# EAGLE schematic Amplifier (EAGLE 9.6.2)
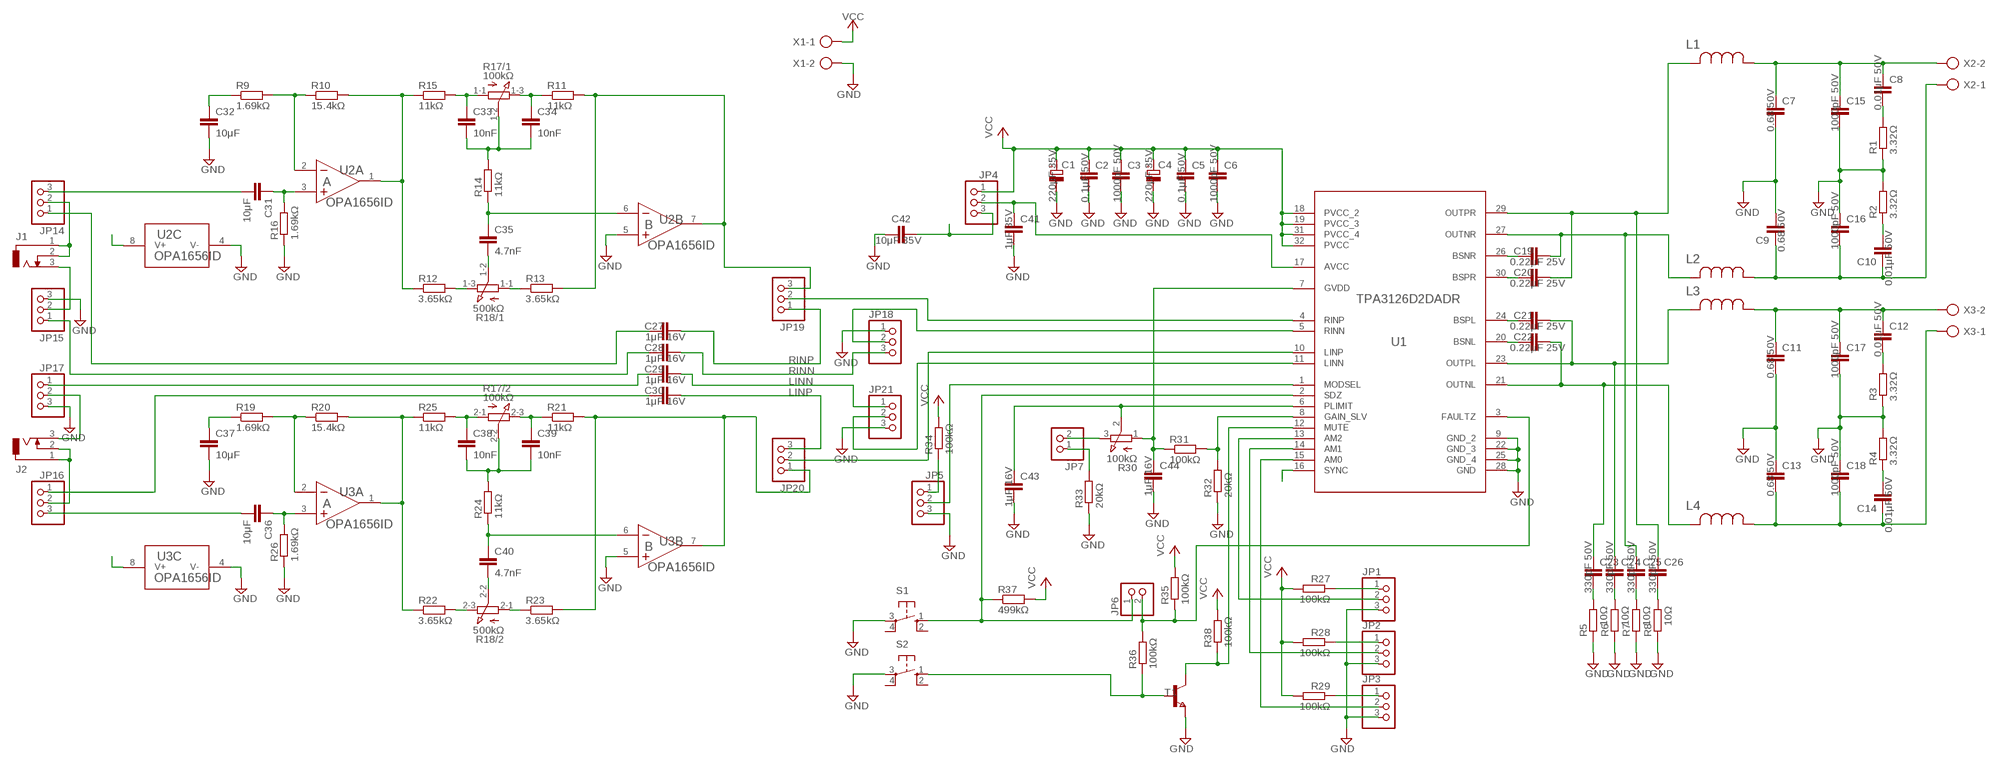
[diagram p0: schematic, sheet 1]

## Parts
C1  220μF 35V  CPOL-EUE3.5-10  [E3,5-10]
C2  0.1μF 50V  C-EUC0805  [C0805]
C3  1000pF 50V  C-EUC0805  [C0805]
C4  220μF 35V  CPOL-EUE3.5-10  [E3,5-10]
C5  0.1μF 50V  C-EUC0805  [C0805]
C6  1000pF 50V  C-EUC0805  [C0805]
C7  0.68 50V  C-EUC0805  [C0805]
C8  0.01μF 50V  C-EUC0805  [C0805]
C9  0.68 50V  C-EUC0805  [C0805]
C10  0.01μF 50V  C-EUC0805  [C0805]
C11  0.68 50V  C-EUC0805  [C0805]
C12  0.01μF 50V  C-EUC0805  [C0805]
C13  0.68 50V  C-EUC0805  [C0805]
C14  0.01μF 50V  C-EUC0805  [C0805]
C15  1000pF 50V  C-EUC0603  [C0603]
C16  1000pF 50V  C-EUC0603  [C0603]
C17  1000pF 50V  C-EUC0603  [C0603]
C18  1000pF 50V  C-EUC0603  [C0603]
C19  0.22μF 25V  C-EUC0603  [C0603]
C20  0.22μF 25V  C-EUC0603  [C0603]
C21  0.22μF 25V  C-EUC0603  [C0603]
C22  0.22μF 25V  C-EUC0603  [C0603]
C23  330pF 50V  C-EUC0603  [C0603]
C24  330pF 50V  C-EUC0603  [C0603]
C25  330pF 50V  C-EUC0603  [C0603]
C26  330pF 50V  C-EUC0603  [C0603]
C27  1μF 16V  C-EUC0805  [C0805]
C28  1μF 16V  C-EUC0805  [C0805]
C29  1μF 16V  C-EUC0805  [C0805]
C30  1μF 16V  C-EUC0805  [C0805]
C31  10μF  C-EUC0805  [C0805]
C32  10μF  C-EUC0805  [C0805]
C33  10nF  C-EUC0603  [C0603]
C34  10nF  C-EUC0603  [C0603]
C35  4.7nF  C-EUC0603  [C0603]
C36  10μF  C-EUC0805  [C0805]
C37  10μF  C-EUC0805  [C0805]
C38  10nF  C-EUC0603  [C0603]
C39  10nF  C-EUC0603  [C0603]
C40  4.7nF  C-EUC0603  [C0603]
C41  1μF 35V  C-EUC0603  [C0603]
C42  10μF 35V  C-EUC1210  [C1210]
C43  1μF 16V  C-EUC0805  [C0805]
C44  1μF 16V  C-EUC0805  [C0805]
J1  DCJ0303  [DCJ0303]
J2  DCJ0303  [DCJ0303]
JP1  PINHD-1X3  [1X03]
JP2  PINHD-1X3  [1X03]
JP3  PINHD-1X3  [1X03]
JP4  PINHD-1X3  [1X03]
JP5  PINHD-1X3  [1X03]
JP6  PINHD-1X2  [1X02]
JP7  PINHD-1X2  [1X02]
JP14  PINHD-1X3  [1X03]
JP15  PINHD-1X3  [1X03]
JP16  PINHD-1X3  [1X03]
JP17  PINHD-1X3  [1X03]
JP18  PINHD-1X3  [1X03]
JP19  PINHD-1X3  [1X03]
JP20  PINHD-1X3  [1X03]
JP21  PINHD-1X3  [1X03]
L1  7447709100  [IND_1210-WE-PD_WRE]
L2  7447709100  [IND_1210-WE-PD_WRE]
L3  7447709100  [IND_1210-WE-PD_WRE]
L4  7447709100  [IND_1210-WE-PD_WRE]
R1  3.32Ω  R-EU_R0603  [R0603]
R2  3.32Ω  R-EU_R0603  [R0603]
R3  3.32Ω  R-EU_R0603  [R0603]
R4  3.32Ω  R-EU_R0603  [R0603]
R5  10Ω  R-EU_R0805  [R0805]
R6  10Ω  R-EU_R0805  [R0805]
R7  10Ω  R-EU_R0805  [R0805]
R8  10Ω  R-EU_R0805  [R0805]
R9  1.69kΩ  R-EU_R1206  [R1206]
R10  15.4kΩ  R-EU_R1206  [R1206]
R11  11kΩ  R-EU_R1206  [R1206]
R12  3.65kΩ  R-EU_R1206  [R1206]
R13  3.65kΩ  R-EU_R1206  [R1206]
R14  11kΩ  R-EU_R1206  [R1206]
R15  11kΩ  R-EU_R1206  [R1206]
R16  1.69kΩ  R-EU_R1206  [R1206]
R17  100kΩ  3RP/1610G  [3RP/1610G]
R18  500kΩ  3RP/1610G  [3RP/1610G]
R19  1.69kΩ  R-EU_R1206  [R1206]
R20  15.4kΩ  R-EU_R1206  [R1206]
R21  11kΩ  R-EU_R1206  [R1206]
R22  3.65kΩ  R-EU_R1206  [R1206]
R23  3.65kΩ  R-EU_R1206  [R1206]
R24  11kΩ  R-EU_R1206  [R1206]
R25  11kΩ  R-EU_R1206  [R1206]
R26  1.69kΩ  R-EU_R1206  [R1206]
R27  100kΩ  R-EU_M0805  [M0805]
R28  100kΩ  R-EU_M0805  [M0805]
R29  100kΩ  R-EU_M0805  [M0805]
R30  100kΩ  3RP/1610N  [3RP/1610N]
R31  100kΩ  R-EU_R0805  [R0805]
R32  20kΩ  R-EU_R0805  [R0805]
R33  20kΩ  R-EU_R0805  [R0805]
R34  100kΩ  R-EU_R0805  [R0805]
R35  100kΩ  R-EU_R0805  [R0805]
R36  100kΩ  R-EU_R0805  [R0805]
R37  499kΩ  R-EU_R0805  [R0805]
R38  100kΩ  R-EU_R0805  [R0805]
S1  10-XX  [B3F-10XX]
S2  10-XX  [B3F-10XX]
T1  NPNSOT23  [SOT-23]
U1  TPA3126D2DADR  [DAD0032A_N]
U2  OPA1656ID  [D0008A_N]
U3  OPA1656ID  [D0008A_N]
X1  AK500/2  [AK500/2]
X2  AK500/2  [AK500/2]
X3  AK500/2  [AK500/2]

## Nets
GND: C1.- C2.2 C3.2 C4.- C5.2 C6.2 C7.2 C9.2 C11.2 C13.1 C15.2 C16.1 C17.2 C18.1 C32.2 C37.2 C41.2 C42.1 C43.2 C44.2 JP1.3 JP2.3 JP3.3 JP5.3 JP15.3 JP17.3 JP18.1 JP21.3 R1.1 R2.2 R3.1 R4.2 R5.1 R6.1 R7.1 R8.1 R16.1 R26.1 R32.1 R33.1 S1.3(P) S2.3(P) T1.2(E) U1.9(GND_2) U1.22(GND_3) U1.25(GND_4) U1.28(GND) U2.4(C:V-) U2.5(B:IN+) U3.4(C:V-) U3.5(B:IN+) X1.2
LINN: C29.2 JP21.1
LINP: C30.1 C30.2 JP16.1 JP20.3
N$1: C32.1 R9.1
N$2: R9.2 R10.1 U2.2(A:IN-)
N$3: C31.1 R16.2 U2.3(A:IN+)
N$4: R10.2 R12.1 R15.1 U2.1(A:OUT)
N$5: R12.2 R18.1-3(/1:E)
N$6: R13.1 R18.1-1(/1:A)
N$7: C33.1 R15.2 R17.1-1(/1:A)
N$8: C34.1 R11.1 R17.1-3(/1:E)
N$9: C33.2 C34.2 R14.2 R17.1-2(/1:S)
N$10: C35.1 R14.1 U2.6(B:IN-)
N$11: C35.2 R18.1-2(/1:S)
N$12: JP19.3 R11.2 R13.2 U2.7(B:OUT)
N$13: C37.1 R19.1
N$14: R19.2 R20.1 U3.2(A:IN-)
N$15: C36.1 R26.2 U3.3(A:IN+)
N$16: R20.2 R22.1 R25.1 U3.1(A:OUT)
N$17: R18.2-3(/2:E) R22.2
N$18: R18.2-1(/2:A) R23.1
N$19: C38.1 R17.2-1(/2:A) R25.2
N$20: C39.1 R17.2-3(/2:E) R21.1
N$21: C38.2 C39.2 R17.2-2(/2:S) R24.2
N$22: C40.1 R24.1 U3.6(B:IN-)
N$23: C40.2 R18.2-2(/2:S)
N$24: JP21.2 U1.11(LINN)
N$25: C20.2 C26.1 L1.2 U1.29(OUTPR)
N$26: C7.1 C8.1 C15.1 L1.1 X2.2
N$27: JP6.2 R35.1 R36.2 U1.3(FAULTZ)
N$28: C9.1 C10.1 C16.2 L2.1 X2.1
N$29: C21.2 C24.1 L3.2 U1.23(OUTPL)
N$30: C22.2 C23.1 L4.2 U1.21(OUTNL)
N$31: C13.2 C14.1 C18.2 L4.1 X3.1
N$32: C11.1 C12.1 C17.1 L3.1 X3.2
N$33: C19.1 U1.26(BSNR)
N$34: C20.1 U1.30(BSPR)
N$35: C21.1 U1.24(BSPL)
N$36: C22.1 U1.20(BSNL)
N$37: C42.2 JP4.3
N$38: C26.2 R8.2
N$39: C25.2 R7.2
N$40: C24.2 R6.2
N$41: C23.2 R5.2
N$42: U1.16(SYNC)
N$43: JP3.2 U1.15(AM0)
N$44: C12.2 R3.2
N$45: C14.2 R4.1
N$46: JP2.2 U1.14(AM1)
N$47: C10.2 R2.1
N$48: C8.2 R1.2
N$49: J1.3 JP15.2
N$50: JP1.2 U1.13(AM2)
N$51: JP1.1 R27.1
N$52: JP2.1 R28.1
N$53: JP3.1 R29.1
N$54: J1.1 J1.2 JP14.2
N$55: J2.1 J2.2 JP16.2
N$56: J2.3 JP17.2
N$57: C31.2 JP14.3
N$58: C36.2 JP16.3
N$59: JP20.1 R21.2 R23.2 U3.7(B:OUT)
N$60: JP19.2 U1.4(RINP)
N$61: JP20.2 U1.10(LINP)
N$62: C43.1 R30.2(S) U1.6(PLIMIT)
N$63: U2.8(C:V+)
N$64: C41.1 JP4.2 U1.17(AVCC)
N$65: JP18.2 U1.5(RINN)
N$66: C29.1 JP17.1
N$67: C19.2 C25.1 L2.2 U1.27(OUTNR)
N$68: JP7.2 R30.3(E)
N$69: JP7.1 R33.2
N$70: C44.1 R30.1(A) R31.1 U1.7(GVDD)
N$71: R31.2 R32.2 U1.8(GAIN_SLV)
N$72: JP5.2 U1.1(MODSEL)
N$73: JP5.1 R34.1
N$74: JP6.1 R37.1 S1.1(S) U1.2(SDZ)
N$75: R36.1 S2.1(S) T1.3(B)
N$76: U3.8(C:V+)
N$80: R38.1 T1.1(C) U1.12(MUTE)
RINN: C28.1 C28.2 JP15.1 JP18.3
RINP: C27.1 C27.2 JP14.1 JP19.1
VCC: C1.+ C2.1 C3.1 C4.+ C5.1 C6.1 JP4.1 R27.2 R28.2 R29.2 R34.2 R35.2 R37.2 R38.2 U1.18(PVCC_2) U1.19(PVCC_3) U1.31(PVCC_4) U1.32(PVCC) X1.1
Unconnected: S1.2(S1) S1.4(P1) S2.2(S1) S2.4(P1)

## Library data of the parts
C1 C4 = rcl:CPOL-EU: POLARIZED CAPACITOR, European symbol; SPICEPREFIX: C
C2 C3 C5-C44 = rcl:C-EU: CAPACITOR, European symbol; SPICEPREFIX: C
J1 J2 = con-jack:DCJ0303: DC POWER JACK Source: DCJ0303.pdf; OC_FARNELL: unknown; OC_NEWARK: unknown
JP1-JP5 JP14-JP21 = pinhead:PINHD-1X3: PIN HEADER
JP6 JP7 = pinhead:PINHD-1X2: PIN HEADER
L1-L4 = Inductors:7447709100; COPYRIGHT: Copyright (C) 2023 Ultra Librarian. All rights reserved.; MANUFACTURER_PART_NUMBER: 7447709100; MFR_NAME: Wurth Electronics
R1-R16 R19-R29 R31-R38 = rcl:R-EU_: RESISTOR, European symbol; SPICEPREFIX: R
R17 R18 = pot:3RP/1610G: 16mm Potentiometer two level Source: http://www.alphapotentiometers.net/html/16mm_pot_2.html
R30 = pot:3RP/1610N: 16mm Potentiometer one level Source: http://www.alphapotentiometers.net/html/16mm_pot_2.html
S1 S2 = switch-omron:10-XX: OMRON SWITCH; MPN: B3F-1000; OC_FARNELL: 176432; OC_NEWARK: 36M3542
T1 = zetex:NPNSOT23: NPN TRANSISTOR; MPN: DSS20201L-7; OC_FARNELL: 1710688; OC_NEWARK: 25R4555
U1 = TexasInstruments:TPA3126D2DADR; COPYRIGHT: Copyright (C) 2023 Ultra Librarian. All rights reserved.; MANUFACTURER_PART_NUMBER: TPA3126D2DADR; MFR_NAME: Texas Instruments; REFDES: RefDes; TYPE: TYPE
U2 U3 = TexasInstruments:OPA1656ID; COPYRIGHT: Copyright (C) 2023 Ultra Librarian. All rights reserved.; MANUFACTURER_PART_NUMBER: OPA1656ID; MFR_NAME: Texas Instruments; REFDES: RefDes; TYPE: TYPE
X1-X3 = con-ptr500:AK500/2: CONNECTOR; OC_FARNELL: unknown; OC_NEWARK: unknown